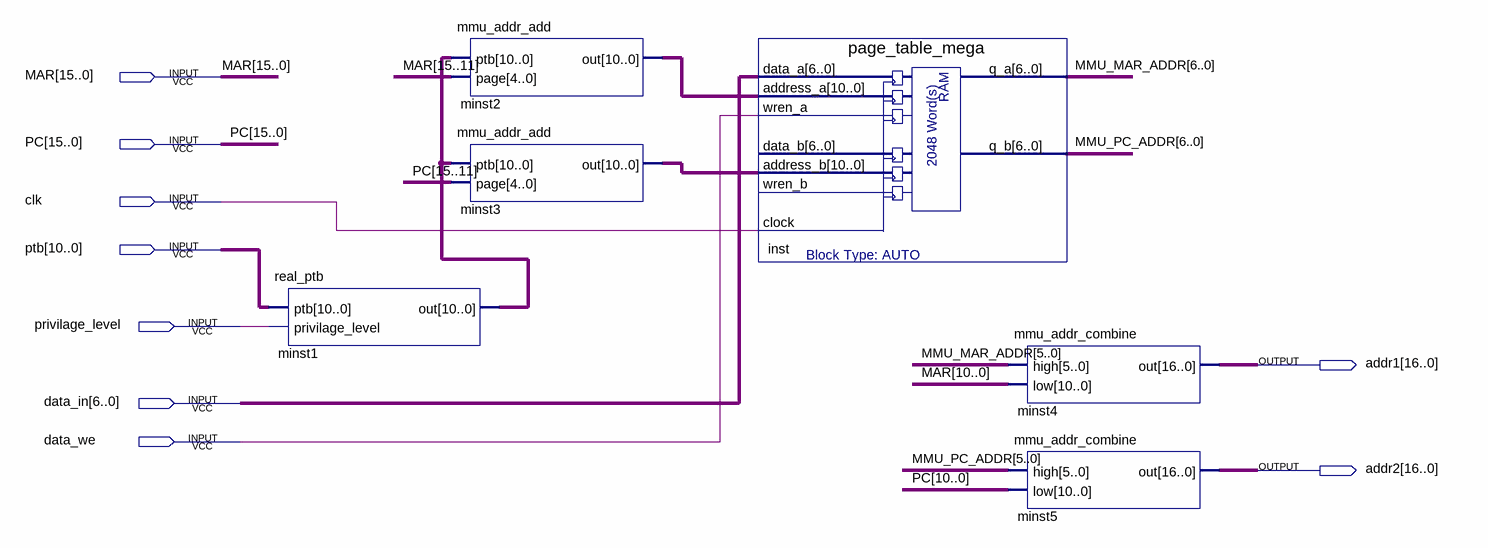
[diagram p0: schematic sheet]
// Quartus schematic mmu.bdf as structural Verilog: 6 symbols, 9 pins
module mmu (
  input  [15:0] MAR,
  input  [15:0] PC,
  input  clk,
  input  [10:0] ptb,
  input  privilage_level,
  input  [6:0] data_in,
  input  data_we,
  output [16:0] addr1,
  output [16:0] addr2
);

  wire [6:0] MMU_MAR_ADDR, MMU_PC_ADDR;
  wire [10:0] minst1_out, minst2_out, minst3_out;

  real_ptb minst1 (.ptb(ptb), .privilage_level(privilage_level), .out(minst1_out));
  mmu_addr_add minst2 (.ptb(minst1_out), .page(MAR[15:11]), .out(minst2_out));
  mmu_addr_add minst3 (.ptb(minst1_out), .page(PC[15:11]), .out(minst3_out));
  page_table_mega inst (
    .data_a(data_in), .address_a(minst2_out), .wren_a(data_we), .address_b(minst3_out), .clock(clk),
    .q_a(MMU_MAR_ADDR), .q_b(MMU_PC_ADDR));  // open: data_b, wren_b
  mmu_addr_combine minst4 (.high(MMU_MAR_ADDR[5:0]), .low(MAR[10:0]), .out(addr1));
  mmu_addr_combine minst5 (.high(MMU_PC_ADDR[5:0]), .low(PC[10:0]), .out(addr2));
endmodule
